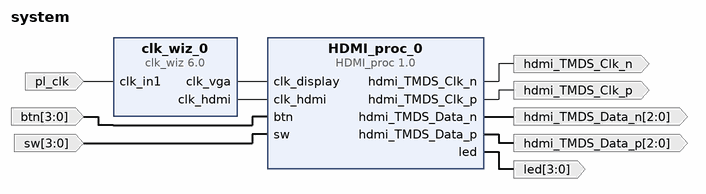
[diagram p0: block diagram of the top level]
# Vivado block design system, xc7z020clg400-1, Vivado 2020.2
create_bd_design system

create_bd_port -dir I -type clk pl_clk
set_property -dict {CONFIG.FREQ_HZ 125000000} [get_bd_ports pl_clk]
create_bd_port -dir I -from 3 -to 0 btn
create_bd_port -dir I -from 3 -to 0 sw
create_bd_port -dir O -type clk hdmi_TMDS_Clk_p
create_bd_port -dir O -type clk hdmi_TMDS_Clk_n
create_bd_port -dir O -from 2 -to 0 hdmi_TMDS_Data_p
create_bd_port -dir O -from 2 -to 0 hdmi_TMDS_Data_n
create_bd_port -dir O -from 3 -to 0 led

create_bd_cell -type ip -vlnv xilinx.com:ip:clk_wiz:6.0 clk_wiz_0
set_property -dict [list \
  CONFIG.CLKIN1_JITTER_PS 80.0 \
  CONFIG.CLKOUT1_JITTER 173.196 \
  CONFIG.CLKOUT1_PHASE_ERROR 104.065 \
  CONFIG.CLKOUT1_REQUESTED_OUT_FREQ 25.000 \
  CONFIG.CLKOUT2_JITTER 125.031 \
  CONFIG.CLKOUT2_PHASE_ERROR 104.065 \
  CONFIG.CLKOUT2_REQUESTED_OUT_FREQ 125.000 \
  CONFIG.CLKOUT2_USED true \
  CONFIG.CLKOUT3_JITTER 117.310 \
  CONFIG.CLKOUT3_PHASE_ERROR 104.065 \
  CONFIG.CLKOUT3_REQUESTED_OUT_FREQ 180.000 \
  CONFIG.CLKOUT3_USED true \
  CONFIG.CLK_IN1_BOARD_INTERFACE sys_clock \
  CONFIG.CLK_OUT1_PORT clk_vga \
  CONFIG.CLK_OUT2_PORT clk_hdmi \
  CONFIG.CLK_OUT3_PORT clk_camera \
  CONFIG.MMCM_CLKFBOUT_MULT_F 7.000 \
  CONFIG.MMCM_CLKIN1_PERIOD 8.000 \
  CONFIG.MMCM_CLKOUT0_DIVIDE_F 35.000 \
  CONFIG.MMCM_CLKOUT1_DIVIDE 7 \
  CONFIG.MMCM_CLKOUT2_DIVIDE 5 \
  CONFIG.MMCM_DIVCLK_DIVIDE 1 \
  CONFIG.NUM_OUT_CLKS 3 \
  CONFIG.PRIM_IN_FREQ 125.000 \
  CONFIG.USE_LOCKED false \
  CONFIG.USE_RESET false \
] [get_bd_cells clk_wiz_0]
create_bd_cell -type ip -vlnv cime3:user:HDMI_proc:1.0 HDMI_proc_0

# ---- connections ----

connect_bd_net -net clk_in1_1 [get_bd_ports pl_clk] [get_bd_pins clk_wiz_0/clk_in1]
connect_bd_net [get_bd_ports btn] [get_bd_pins HDMI_proc_0/btn]
connect_bd_net [get_bd_ports sw] [get_bd_pins HDMI_proc_0/sw]
connect_bd_net [get_bd_pins clk_wiz_0/clk_vga] [get_bd_pins HDMI_proc_0/clk_display]
connect_bd_net [get_bd_pins clk_wiz_0/clk_hdmi] [get_bd_pins HDMI_proc_0/clk_hdmi]
connect_bd_net [get_bd_pins HDMI_proc_0/hdmi_TMDS_Clk_p] [get_bd_ports hdmi_TMDS_Clk_p]
connect_bd_net [get_bd_pins HDMI_proc_0/hdmi_TMDS_Clk_n] [get_bd_ports hdmi_TMDS_Clk_n]
connect_bd_net [get_bd_pins HDMI_proc_0/hdmi_TMDS_Data_p] [get_bd_ports hdmi_TMDS_Data_p]
connect_bd_net [get_bd_pins HDMI_proc_0/hdmi_TMDS_Data_n] [get_bd_ports hdmi_TMDS_Data_n]
connect_bd_net [get_bd_pins HDMI_proc_0/led] [get_bd_ports led]

validate_bd_design
save_bd_design
